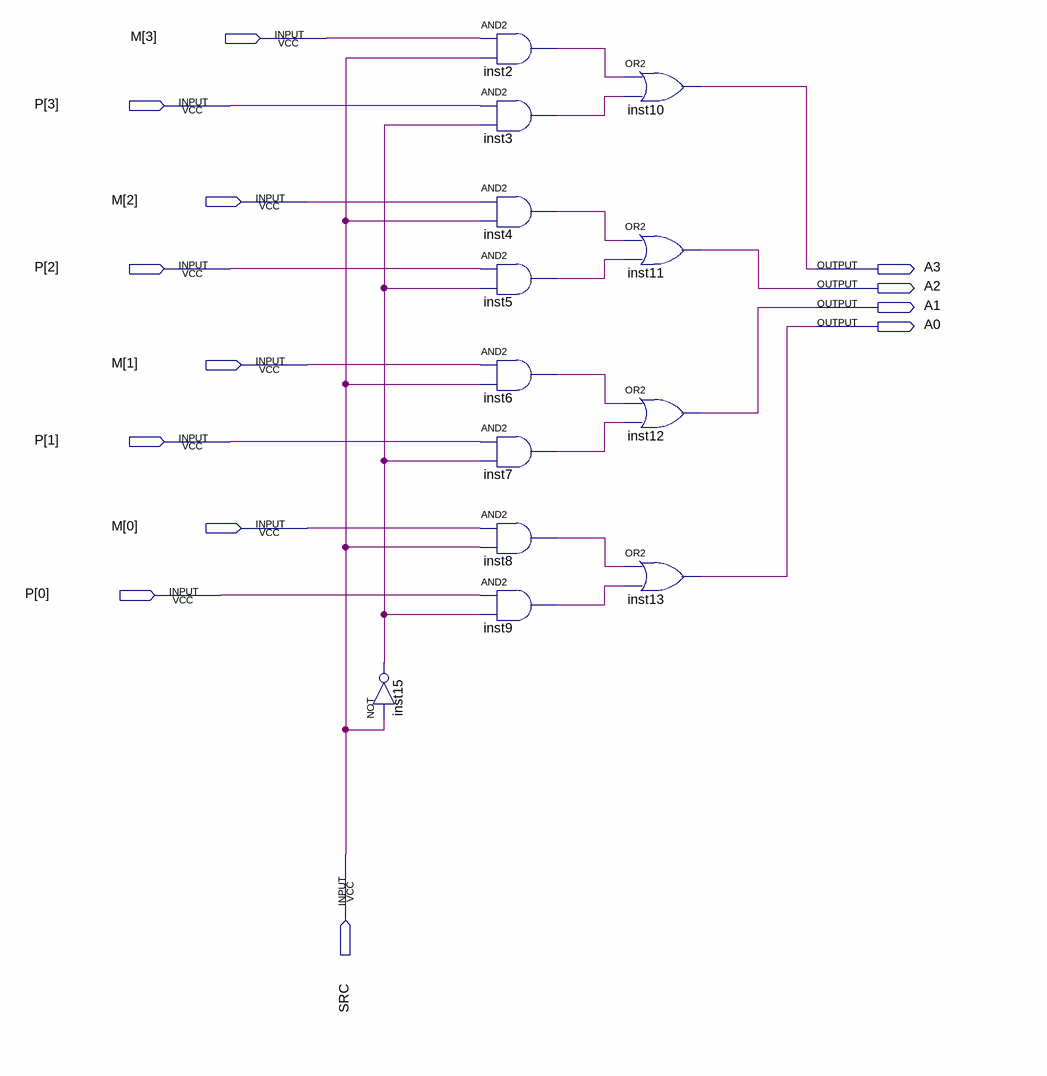
[diagram p0: schematic sheet]
// Quartus schematic Block2.bdf as structural Verilog: 13 symbols, 13 pins
module Block2 (
  input  [3:0] M,
  input  [3:0] P,
  input  SRC,
  output A3,
  output A2,
  output A1,
  output A0
);

  wire inst2_out, inst3_out, inst4_out, inst5_out, inst6_out, inst7_out, inst8_out, inst9_out, inst15_out;

  not inst15 (inst15_out, SRC);
  and inst2 (inst2_out, M[3], SRC);
  and inst3 (inst3_out, P[3], inst15_out);
  and inst4 (inst4_out, M[2], SRC);
  and inst5 (inst5_out, P[2], inst15_out);
  and inst6 (inst6_out, M[1], SRC);
  and inst7 (inst7_out, P[1], inst15_out);
  and inst8 (inst8_out, M[0], SRC);
  and inst9 (inst9_out, P[0], inst15_out);
  or inst10 (A3, inst2_out, inst3_out);
  or inst11 (A2, inst4_out, inst5_out);
  or inst12 (A1, inst6_out, inst7_out);
  or inst13 (A0, inst8_out, inst9_out);
endmodule
